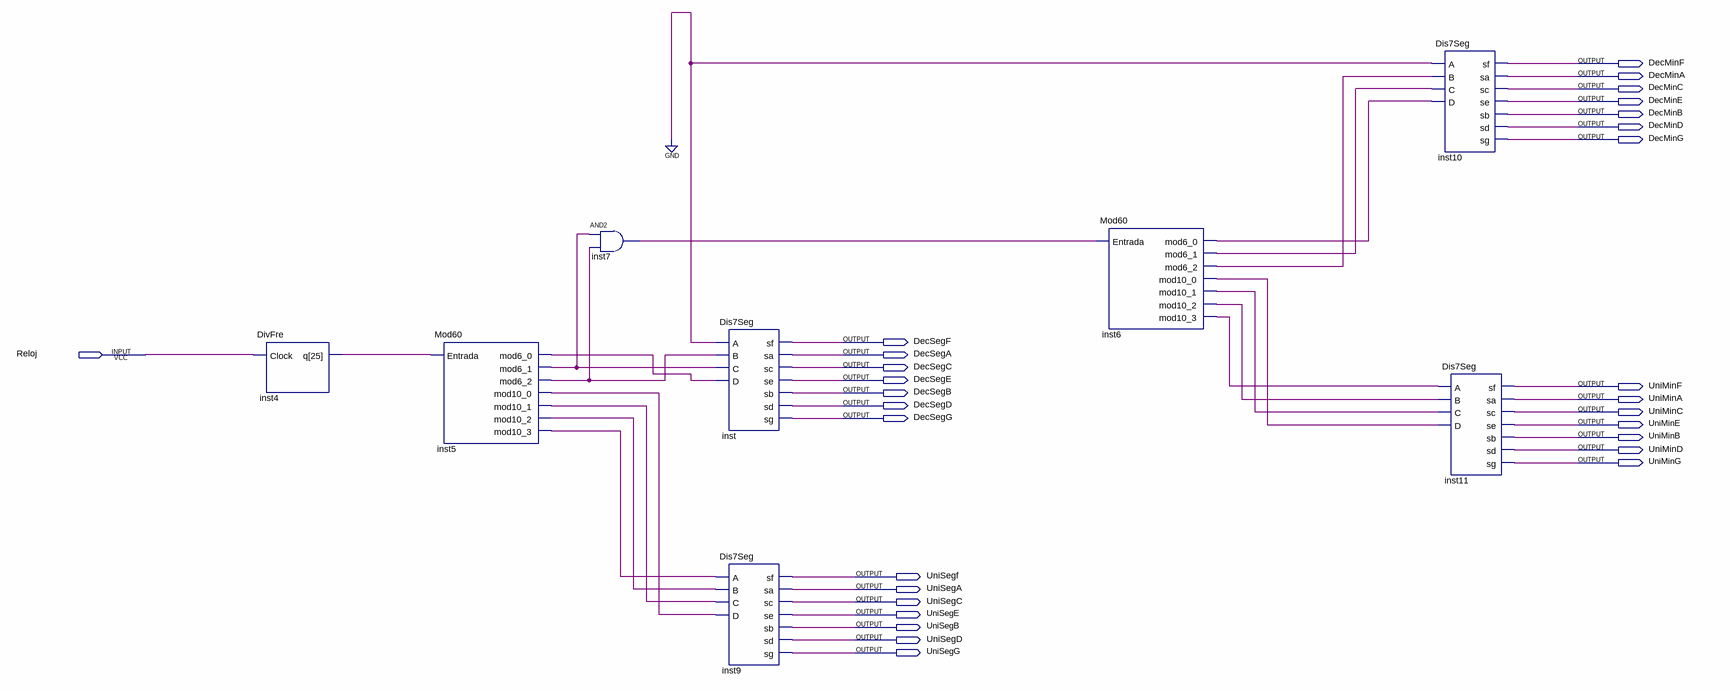
[diagram p0: schematic sheet]
// Quartus schematic RDTR.bdf as structural Verilog: 8 symbols, 29 pins
module RDTR (
  input  Reloj,
  output DecMinF,
  output DecMinA,
  output DecMinC,
  output DecMinE,
  output DecMinB,
  output DecMinD,
  output DecMinG,
  output DecSegF,
  output DecSegA,
  output DecSegC,
  output DecSegE,
  output UniMinF,
  output DecSegB,
  output UniMinA,
  output DecSegD,
  output UniMinC,
  output DecSegG,
  output UniMinE,
  output UniMinB,
  output UniMinD,
  output UniMinG,
  output UniSegf,
  output UniSegA,
  output UniSegC,
  output UniSegE,
  output UniSegB,
  output UniSegD,
  output UniSegG
);

  wire inst4_q, inst5_mod6_0, inst5_mod6_1, inst5_mod6_2, inst5_mod10_0, inst5_mod10_1, inst5_mod10_2,
       inst5_mod10_3, inst6_mod6_0, inst6_mod6_1, inst6_mod6_2, inst6_mod10_0, inst6_mod10_1, inst6_mod10_2,
       inst6_mod10_3, inst7_out;

  DivFre inst4 (.Clock(Reloj), .q(inst4_q));
  Mod60 inst5 (
    .Entrada(inst4_q), .mod6_0(inst5_mod6_0), .mod6_1(inst5_mod6_1), .mod6_2(inst5_mod6_2),
    .mod10_0(inst5_mod10_0), .mod10_1(inst5_mod10_1), .mod10_2(inst5_mod10_2), .mod10_3(inst5_mod10_3));
  and inst7 (inst7_out, inst5_mod6_1, inst5_mod6_2);
  Dis7Seg inst (
    .A(1'b0), .B(inst5_mod6_2), .C(inst5_mod6_1), .D(inst5_mod6_0), .sf(DecSegF), .sa(DecSegA), .sc(DecSegC),
    .se(DecSegE), .sb(DecSegB), .sd(DecSegD), .sg(DecSegG));
  Dis7Seg inst9 (
    .A(inst5_mod10_3), .B(inst5_mod10_2), .C(inst5_mod10_1), .D(inst5_mod10_0), .sf(UniSegf), .sa(UniSegA),
    .sc(UniSegC), .se(UniSegE), .sb(UniSegB), .sd(UniSegD), .sg(UniSegG));
  Mod60 inst6 (
    .Entrada(inst7_out), .mod6_0(inst6_mod6_0), .mod6_1(inst6_mod6_1), .mod6_2(inst6_mod6_2),
    .mod10_0(inst6_mod10_0), .mod10_1(inst6_mod10_1), .mod10_2(inst6_mod10_2), .mod10_3(inst6_mod10_3));
  Dis7Seg inst10 (
    .A(1'b0), .B(inst6_mod6_2), .C(inst6_mod6_1), .D(inst6_mod6_0), .sf(DecMinF), .sa(DecMinA), .sc(DecMinC),
    .se(DecMinE), .sb(DecMinB), .sd(DecMinD), .sg(DecMinG));
  Dis7Seg inst11 (
    .A(inst6_mod10_3), .B(inst6_mod10_2), .C(inst6_mod10_1), .D(inst6_mod10_0), .sf(UniMinF), .sa(UniMinA),
    .sc(UniMinC), .se(UniMinE), .sb(UniMinB), .sd(UniMinD), .sg(UniMinG));
endmodule
